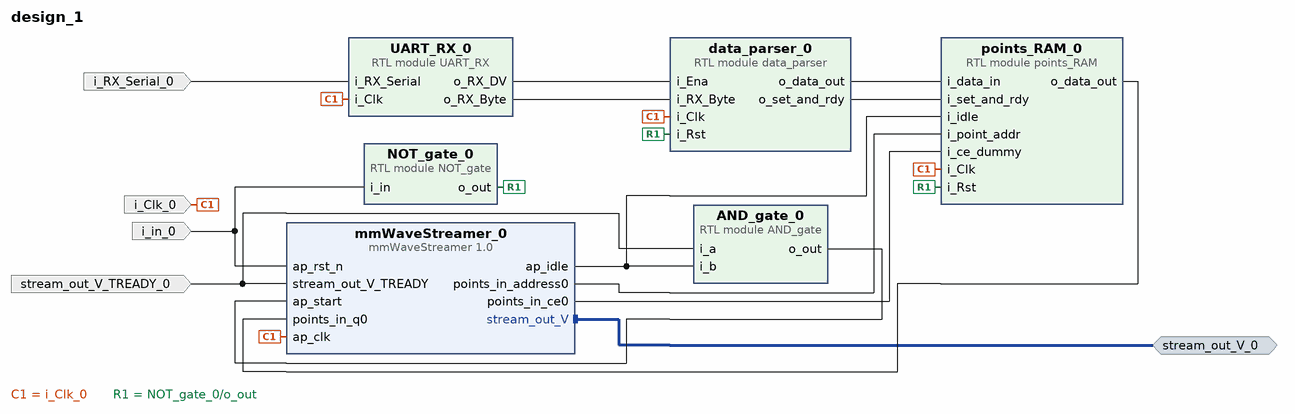
[diagram p0: block diagram of the top level]
# Vivado block design design_1, xczu3eg-sbva484-1-i, Vivado 2020.2
create_bd_design design_1

create_bd_intf_port -mode Master -vlnv xilinx.com:interface:axis_rtl:1.0 stream_out_V_0
create_bd_port -dir I i_in_0
create_bd_port -dir I stream_out_V_TREADY_0
create_bd_port -dir I -type clk i_Clk_0
create_bd_port -dir I i_RX_Serial_0

create_bd_cell -type module -reference NOT_gate NOT_gate_0
create_bd_cell -type module -reference points_RAM points_RAM_0
create_bd_cell -type module -reference data_parser data_parser_0
create_bd_cell -type module -reference AND_gate AND_gate_0
create_bd_cell -type module -reference UART_RX UART_RX_0
create_bd_cell -type ip -vlnv xilinx.com:hls:mmWaveStreamer:1.0 mmWaveStreamer_0

# ---- connections ----

connect_bd_intf_net [get_bd_intf_ports stream_out_V_0] [get_bd_intf_pins mmWaveStreamer_0/stream_out_V]
connect_bd_net -net i_in_0_1 [get_bd_ports i_in_0] [get_bd_pins NOT_gate_0/i_in] [get_bd_pins mmWaveStreamer_0/ap_rst_n]
connect_bd_net -net stream_out_V_TREADY_0_1 [get_bd_ports stream_out_V_TREADY_0] \
  [get_bd_pins mmWaveStreamer_0/stream_out_V_TREADY] [get_bd_pins AND_gate_0/i_a]
connect_bd_net -net i_Clk_0_1 [get_bd_ports i_Clk_0] \
  [get_bd_pins UART_RX_0/i_Clk] [get_bd_pins points_RAM_0/i_Clk] [get_bd_pins mmWaveStreamer_0/ap_clk] \
  [get_bd_pins data_parser_0/i_Clk]
connect_bd_net -net i_RX_Serial_0_1 [get_bd_ports i_RX_Serial_0] [get_bd_pins UART_RX_0/i_RX_Serial]
connect_bd_net [get_bd_pins NOT_gate_0/o_out] [get_bd_pins data_parser_0/i_Rst] [get_bd_pins points_RAM_0/i_Rst]
connect_bd_net [get_bd_pins UART_RX_0/o_RX_DV] [get_bd_pins data_parser_0/i_Ena]
connect_bd_net [get_bd_pins UART_RX_0/o_RX_Byte] [get_bd_pins data_parser_0/i_RX_Byte]
connect_bd_net [get_bd_pins mmWaveStreamer_0/ap_idle] [get_bd_pins AND_gate_0/i_b] [get_bd_pins points_RAM_0/i_idle]
connect_bd_net [get_bd_pins AND_gate_0/o_out] [get_bd_pins mmWaveStreamer_0/ap_start]
connect_bd_net [get_bd_pins points_RAM_0/o_data_out] [get_bd_pins mmWaveStreamer_0/points_in_q0]
connect_bd_net [get_bd_pins mmWaveStreamer_0/points_in_address0] [get_bd_pins points_RAM_0/i_point_addr]
connect_bd_net [get_bd_pins data_parser_0/o_data_out] [get_bd_pins points_RAM_0/i_data_in]
connect_bd_net [get_bd_pins data_parser_0/o_set_and_rdy] [get_bd_pins points_RAM_0/i_set_and_rdy]
connect_bd_net [get_bd_pins mmWaveStreamer_0/points_in_ce0] [get_bd_pins points_RAM_0/i_ce_dummy]

validate_bd_design
save_bd_design
